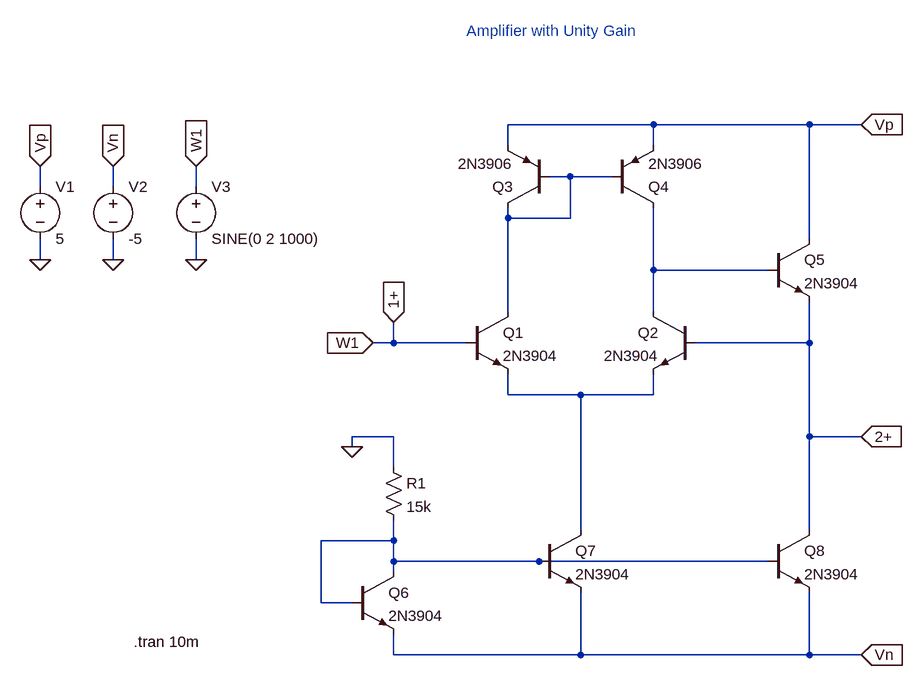
[diagram p0: schematic amp_with_unity_gain_ltspice.asc]
amp_with_unity_gain_ltspice.asc, the LTspice schematic file:
Version 4
SHEET 1 1088 680
WIRE 352 -384 128 -384
WIRE 592 -384 352 -384
WIRE 672 -384 592 -384
WIRE 128 -352 128 -384
WIRE 352 -352 352 -384
WIRE 224 -304 192 -304
WIRE 288 -304 224 -304
WIRE -592 -288 -592 -320
WIRE -480 -288 -480 -320
WIRE -352 -288 -352 -320
WIRE 128 -240 128 -256
WIRE 224 -240 224 -304
WIRE 224 -240 128 -240
WIRE 592 -208 592 -384
WIRE -592 -176 -592 -208
WIRE -480 -176 -480 -208
WIRE -352 -176 -352 -208
WIRE 352 -160 352 -256
WIRE 528 -160 352 -160
WIRE 128 -96 128 -240
WIRE 352 -96 352 -160
WIRE -48 -48 -48 -80
WIRE -48 -48 -80 -48
WIRE 64 -48 -48 -48
WIRE 592 -48 592 -112
WIRE 592 -48 416 -48
WIRE 128 32 128 0
WIRE 240 32 128 32
WIRE 352 32 352 0
WIRE 352 32 240 32
WIRE -48 96 -112 96
WIRE 592 96 592 -48
WIRE 672 96 592 96
WIRE -112 112 -112 96
WIRE -48 144 -48 96
WIRE 240 240 240 32
WIRE 592 240 592 96
WIRE -48 256 -48 224
WIRE -48 256 -160 256
WIRE -48 288 -48 256
WIRE 176 288 -48 288
WIRE 528 288 176 288
WIRE -48 304 -48 288
WIRE -160 352 -160 256
WIRE -112 352 -160 352
WIRE -48 432 -48 400
WIRE 240 432 240 336
WIRE 240 432 -48 432
WIRE 592 432 592 336
WIRE 592 432 240 432
WIRE 672 432 592 432
FLAG -112 112 0
FLAG -80 -48 W1
IOPIN -80 -48 In
FLAG -48 -80 1+
IOPIN -48 -80 In
FLAG 672 -384 Vp
IOPIN 672 -384 In
FLAG 672 432 Vn
IOPIN 672 432 In
FLAG 672 96 2+
IOPIN 672 96 In
FLAG -592 -176 0
FLAG -480 -176 0
FLAG -352 -176 0
FLAG -592 -320 Vp
IOPIN -592 -320 In
FLAG -480 -320 Vn
IOPIN -480 -320 In
FLAG -352 -320 W1
IOPIN -352 -320 In
SYMBOL npn 64 -96 R0
SYMATTR InstName Q1
SYMATTR Value 2N3904
SYMBOL npn 416 -96 M0
SYMATTR InstName Q2
SYMATTR Value 2N3904
SYMBOL pnp 192 -256 R180
SYMATTR InstName Q3
SYMATTR Value 2N3906
SYMBOL pnp 288 -256 M180
SYMATTR InstName Q4
SYMATTR Value 2N3906
SYMBOL npn 528 -208 R0
SYMATTR InstName Q5
SYMATTR Value 2N3904
SYMBOL npn -112 304 R0
SYMATTR InstName Q6
SYMATTR Value 2N3904
SYMBOL npn 176 240 R0
SYMATTR InstName Q7
SYMATTR Value 2N3904
SYMBOL npn 528 240 R0
SYMATTR InstName Q8
SYMATTR Value 2N3904
SYMBOL res -64 128 R0
SYMATTR InstName R1
SYMATTR Value 15k
SYMBOL voltage -592 -304 R0
WINDOW 123 0 0 Left 0
WINDOW 39 0 0 Left 0
SYMATTR InstName V1
SYMATTR Value 5
SYMBOL voltage -480 -304 R0
WINDOW 123 0 0 Left 0
WINDOW 39 0 0 Left 0
SYMATTR InstName V2
SYMATTR Value -5
SYMBOL voltage -352 -304 R0
WINDOW 123 0 0 Left 0
WINDOW 39 0 0 Left 0
SYMATTR InstName V3
SYMATTR Value SINE(0 2 1000)
TEXT 64 -528 Left 2 ;Amplifier with Unity Gain
TEXT -448 412 Left 2 !.tran 10m

The netlist it stands for:
* amp_with_unity_gain_ltspice.asc
Q1 N001 1+ N003 0 2N3904
Q2 N002 2+ N003 0 2N3904
Q3 N001 N001 Vp 0 2N3906
Q4 N002 N001 Vp 0 2N3906
Q5 Vp N002 2+ 0 2N3904
Q6 N004 N004 Vn 0 2N3904
Q7 N003 N004 Vn 0 2N3904
Q8 2+ N004 Vn 0 2N3904
R1 0 N004 15k
V1 Vp 0 5
V2 Vn 0 -5
V3 1+ 0 SINE(0 2 1000)
.model NPN NPN
.model PNP PNP
.lib standard.bjt
* Amplifier with Unity Gain
.tran 10m
.backanno
.end